# EasyEDA Pro project STC8G1K08A.epro

# Schematic Schematic1
Create Date: 2022-10-18; Page Name: P1; Project Name: STC8G1K08A; Schematic Name: Schematic1; Update Date: 2022-10-23; Company: 嘉立创EDA; Page Size: A4; Version: V1.0
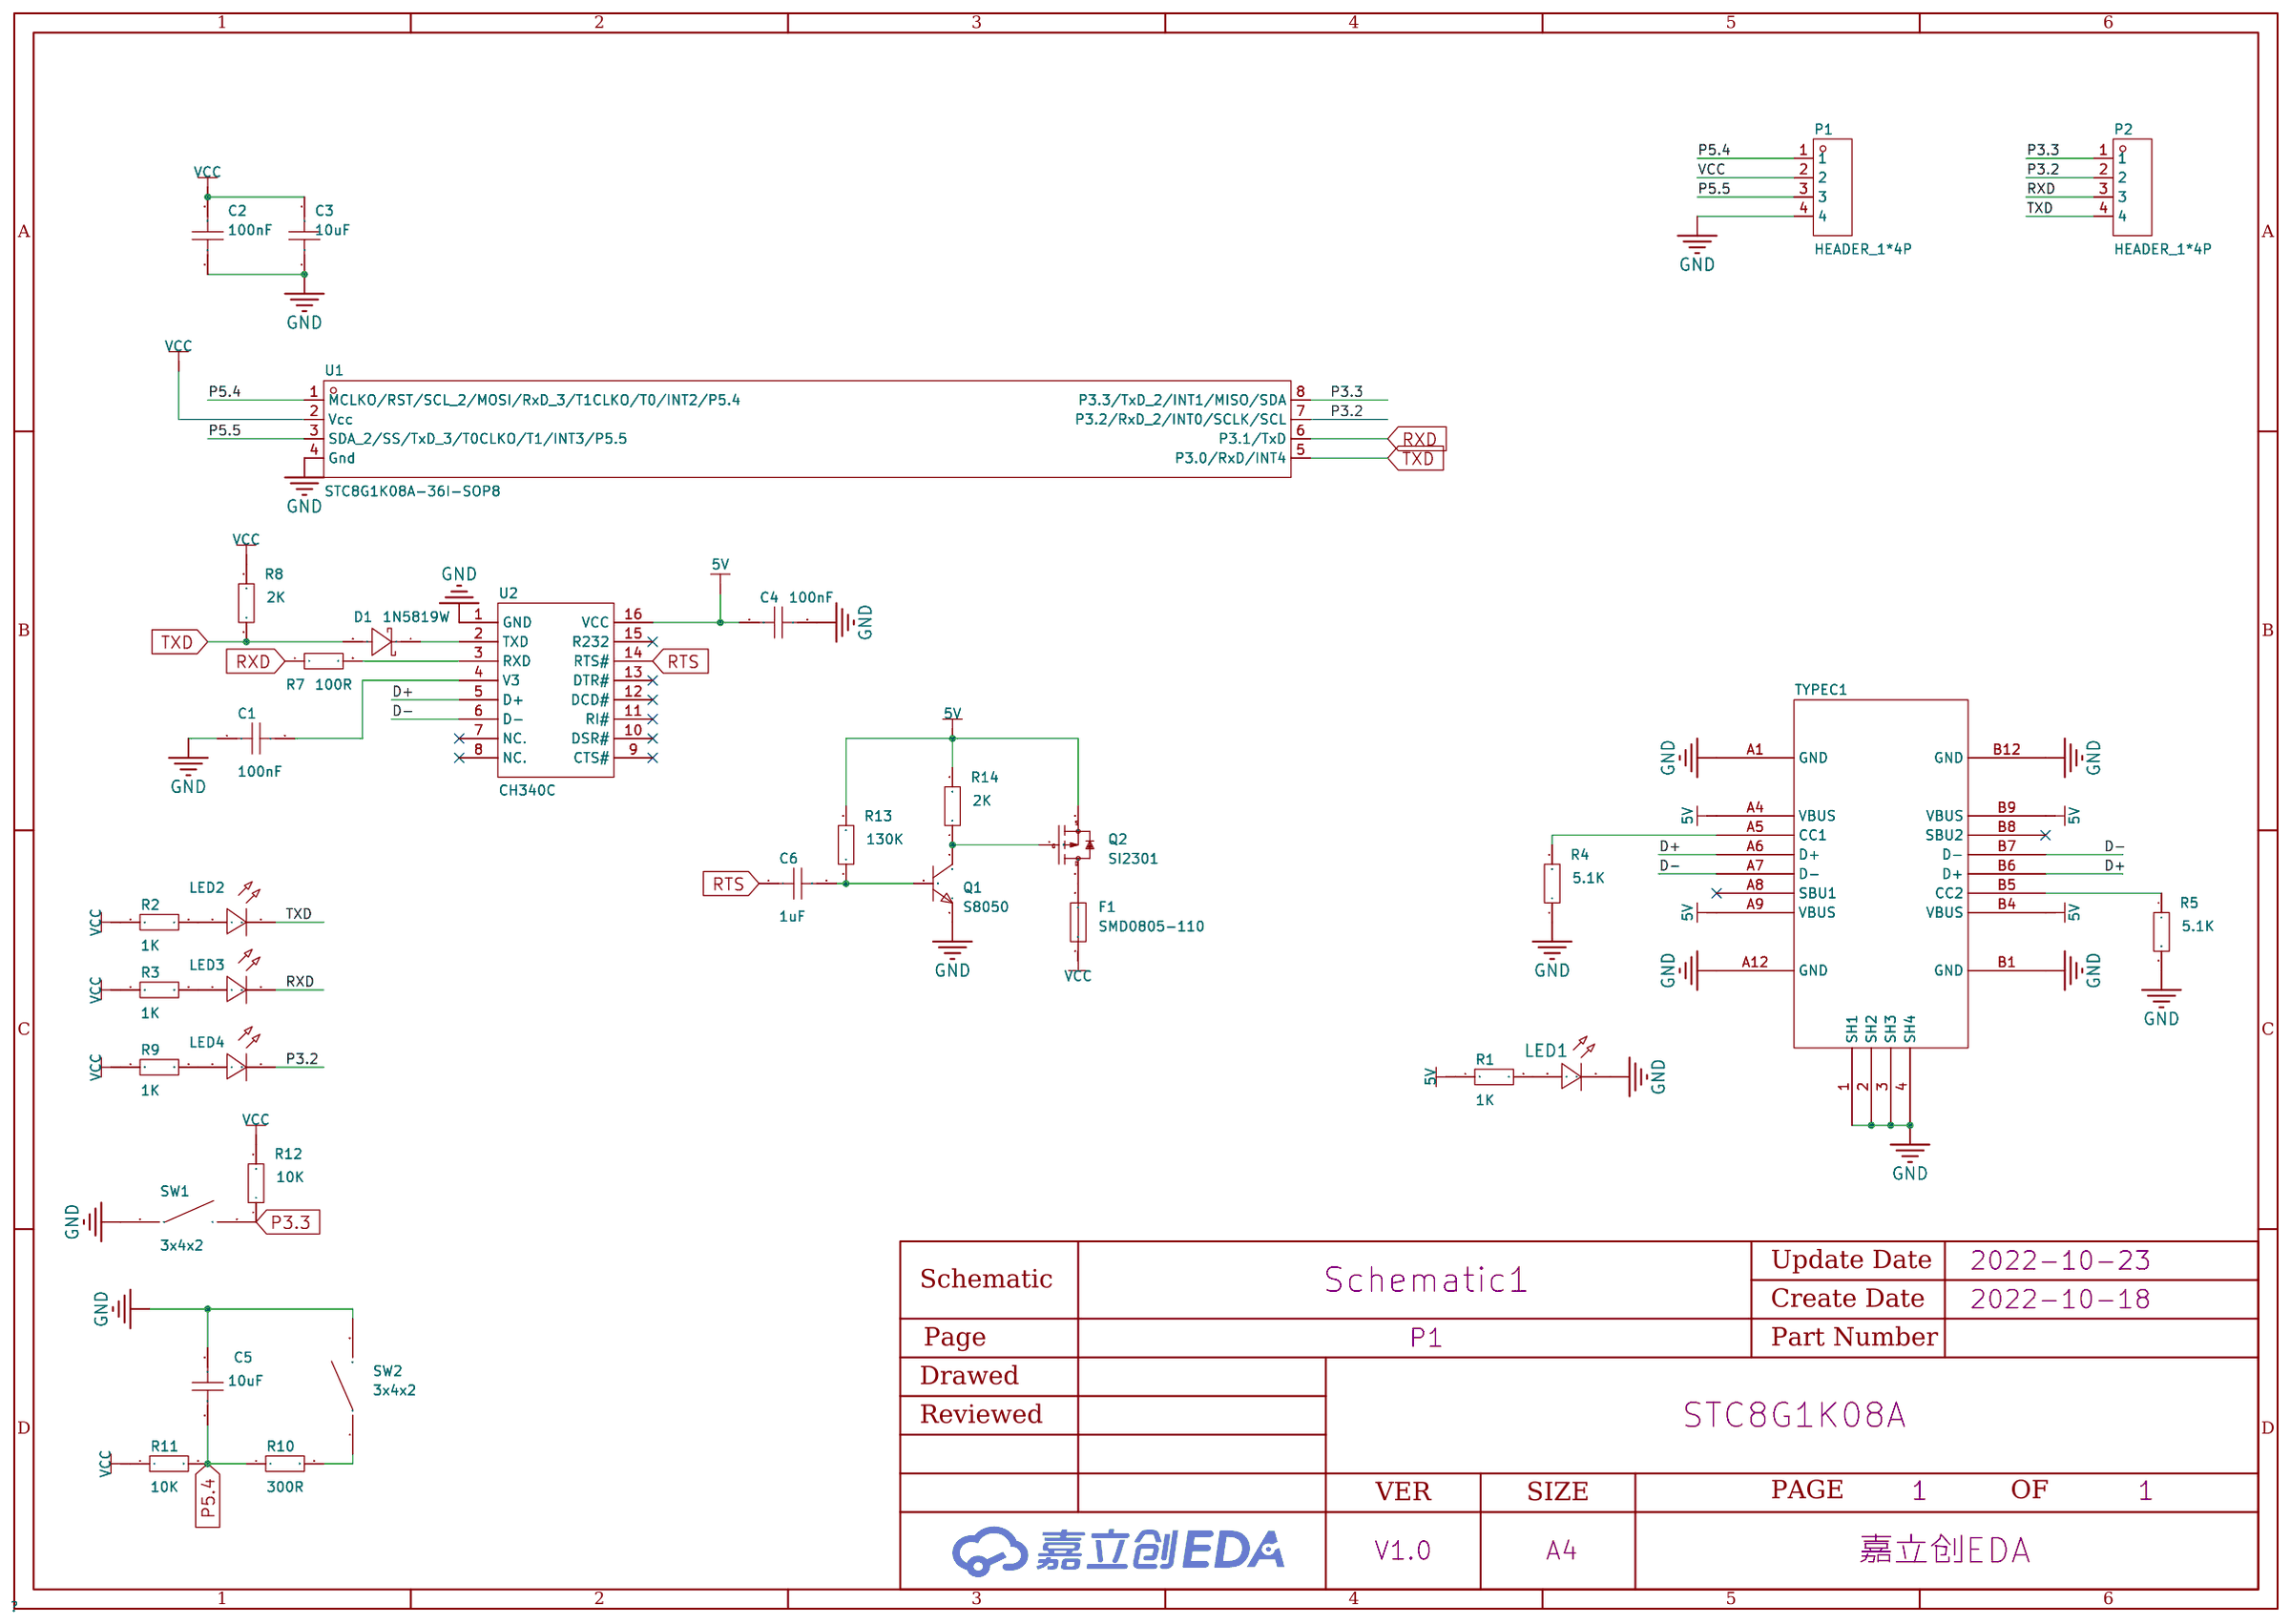
[diagram p0: schematic sheet]

## Parts
C1  100nF  [C0603]
C2  100nF  [C0603]
C3  100nF  [C0603]
C4  100nF  [C0603]
C5  100nF  [C0603]
C6  100nF  [C0603]
D1  1N5819W  [SOD-323_L1.7-W1.3-LS2.6-RD-1]
F1  SMD0805-110  [F0805]
LED1  -  [LED0805-RD_RED]
LED2  -  [LED0805-RD_RED]
LED3  -  [LED0805-RD_RED]
LED4  -  [LED0805-RD_RED]
P1  HEADER_1*4P  [HDR-TH_4P-P2.54-V-M-1]
P2  HEADER_1*4P  [HDR-TH_4P-P2.54-V-M-1]
Q1  S8050  [SOT-23-3_L2.9-W1.3-P1.90-LS2.4-BR]
Q2  SI2301  [SOT-23-3_L2.9-W1.6-P1.90-LS2.8-BR]
R1  10K  [R0603]
R2  10K  [R0603]
R3  10K  [R0603]
R4  10K  [R0603]
R5  10K  [R0603]
R7  10K  [R0603]
R8  10K  [R0603]
R9  10K  [R0603]
R10  10K  [R0603]
R11  10K  [R0603]
R12  10K  [R0603]
R13  10K  [R0603]
R14  10K  [R0603]
SW1  3x4x2  [SW-SMD_L4.0-W2.9-LS5.0]
SW2  3x4x2  [SW-SMD_L4.0-W2.9-LS5.0]
TYPEC1  -  [TypeC-16p]
U1  STC8G1K08A-36I-SOP8  [SOP-8_L5.0-W4.0-P1.27-LS6.0-BL]
U2  CH340C  [SOP-16_L10.0-W3.9-P1.27-LS6.0-BL]

## Library data of the parts
C1-C6 = CAP_0603: Supplier Footprint: 0603
D1 = 1N5819WS S4: 二极管配置:-;直流反向耐压(Vr):40V;平均整流电流(Io):350mA;正向压降(Vf):600mV@200mA;反向电流(Ir):5A@30V;; LCSC Part Name: 40V 350mA 600mV@200mA; Supplier Part: C2939001; Manufacturer: KUU; Supplier Footprint: SOD-323; JLCPCB Part Class: 扩展库; Datasheet: https://atta.szlcsc.com/upload/public/pdf/source/20220104/284BA42B17809E9E0DF150FD0918852F.pdf; Supplier: LCSC; Reverse Voltage (Vr): 40V; Average Rectified Current (Io): 350mA; Forward Voltage (Vf@If): 600mV@200mA; Reverse Leakage Current (Ir): 5A@30V
F1 = SMD0805-110_C883453: 最大电压:6V;最大电流:100A;保持电流:1.1A;跳闸电流:2.2A;消耗功率:600mW;初始态阻值(最小值):60mΩ;跳断后阻值(最大值):210mΩ;最大动作时间:300ms;工作温度:-40~+85;; Supplier Part: C883453; Manufacturer: DOWO(东沃); Supplier Footprint: 0805; JLCPCB Part Class: 扩展库; Datasheet: https://atta.szlcsc.com/upload/public/pdf/source/20201106/C883453_C41FA8401A960BEA648423C0D5CB40C3.pdf; Supplier: LCSC; Operating Voltage (Max): 6V; Current Rating (Max): 100A; Hold Current: 1.1A; Trip Current: 2.2A; Power Dissipation: 600mW; Resistance - Initial (Ri) (Min): 60mΩ; Resistance - Post Trip (R1) (Max): 210mΩ; Maximum Time to Trip: 300ms; Operating Temperature: -40~+85
LED1 = LED_0805-R: Supplier Footprint: 0805
LED2 = LED_0805-G: Supplier Footprint: 0805
LED3 LED4 = LED_0805-B: Supplier Footprint: 0805
P1 P2 = HEADER_1*4P: Supplier Part: C9900003200; Supplier Footprint: TH-4P; JLCPCB Part Class: 扩展库; Datasheet: https://atta.szlcsc.comnull; Supplier: LCSC
Q1 = S8050: NPN 25V 500mA 120-400 SOT-23; Supplier Part: C2931719; Manufacturer: Doeshare(德芯); Supplier Footprint: SOT-23; JLCPCB Part Class: 扩展库; Datasheet: https://atta.szlcsc.com/upload/public/pdf/source/20220117/E6D3315E0D6ADDB25840BFFAC039C5C0.pdf; Supplier: LCSC
Q2 = SI2301_C2985938: 类型:P沟道;漏源电压(Vdss):20V;连续漏极电流(Id):3A;功率(Pd):1.25W;导通电阻(RDS(on)@Vgs,Id):90mΩ@4.5V,2.8A;阈值电压(Vgs(th)@Id):1V@250uA;栅极电荷(Qg@Vgs):10nC@4.5V;输入电容(Ciss@Vds):589pF@16V;反向传输电容(Crss@Vds):68pF@10V;工作温度:+150@(Tj);; LCSC Part Name: P沟道 20V 3A; Supplier Part: C2985938; Manufacturer: KUU; Supplier Footprint: SOT-23-3L; JLCPCB Part Class: 扩展库; Datasheet: https://atta.szlcsc.com/upload/public/pdf/source/20220328/BAD282C8065BB2F010ED3B5450E4D439.pdf; Supplier: LCSC; Type: P沟道; Drain Source Voltage (Vdss): 20V; Continuous Drain Current (Id): 3A; Power Dissipation (Pd): 1.25W; Drain Source On Resistance (RDS(on)@Vgs,Id): 90mΩ@4.5V,2.8A; Gate Threshold Voltage (Vgs(th)@Id): 1V@250uA; Total Gate Charge (Qg@Vgs): 10nC@4.5V; Input Capacitance (Ciss@Vds): 589pF@16V; Reverse Transfer Capacitance (Crss@Vds): 68pF@10V; Operating Temperature: +150@(Tj)
R1-R5 R7-R14 = Res_0603: Supplier Footprint: 0603
SW1 SW2 = TS-1185-C-A-B-B: 触点电流:50mA;额定电压(DC):12V;绝缘电阻:100mΩ;电路结构:单刀单掷;安装方式:立贴;按钮形状:圆形按钮;按钮/盖帽颜色:蓝色;带灯:无;作用力:260gf;机械寿命:100000;工作温度:-30~+85;开关长度:4mm;开关宽度:3mm;开关高度:2mm;带支架:否;; LCSC Part Name: 3*4*2.0硅胶260gf; Supplier Part: C465999; Manufacturer: XKB Connectivity(中国星坤); Supplier Footprint: SMD; JLCPCB Part Class: 扩展库; Datasheet: https://atta.szlcsc.com/upload/public/pdf/source/20211011/1F231F77C87DDA3AFCA2BCBA34277182.pdf; Supplier: LCSC; Contact Current: 50mA; Voltage Rating (DC): 12V; Insulation Resistance: 100mΩ; Circuit: 单刀单掷; Mounting Style: 立贴; Actuator Style: 圆形按钮; Actuator/Cap Color: 蓝色; With Lamp: 无; Operating Force: 260gf; Mechanical Life: 100000; Operating Temperature: -30~+85; Switch Length: 4mm; Switch Width: 3mm; Switch Height: 2mm; Strike Gundam: 否
TYPEC1 = TypeC-16P
U1 = STC8G1K08A-36I-SOP8: CPU内核:51系列;CPU最大主频:-;工作电压范围:1.9V~5.5V;内部振荡器:有;外部时钟频率范围:-;程序 FLASH容量:8KB;RAM总容量:1.25KB;EEPROM/数据 FLASH容量:4KB;GPIO端口数量:6;ADC(单元数/通道数/位数):1@x6ch/10bit;DAC(单元数/通道数/位数):-;(E)PWM(单元数/通道数/位数):-;8位Timer数量:-;16位Timer数量:2;32位Timer数量:-;内部比较器数量:-;U(S)ART路数:1;I2C路数:1;; Supplier Part: C915663; Manufacturer: STC(宏晶); Supplier Footprint: SOP-8; JLCPCB Part Class: 扩展库; Datasheet: https://atta.szlcsc.com/upload/public/pdf/source/20201105/C713818_1666C7558605C197DBF08446D241F69F.pdf; Supplier: LCSC; CPU Core: 51系列; Supply Voltage Range: 1.9V~5.5V; Internal Oscillator: 有; Program FLASH Size: 8KB; RAM Size: 1.25KB; EEPROM/Data FLASH Size: 4KB; GPIO Ports Number: 6; ADC (Units/Channels/bits): 1@x6ch/10bit; 16Bit Timer Number: 2; U(S)ART Number: 1; I2C Number: 1; (Q)SPI Number: 1; Peripherals / Functions / Protocol Stacks: 低电压检测；看门狗；CCP捕获/比较；除法器；乘法器; Operating Temperature Range: -40~+85
U2 = CH340C: 类型:Transceiver;协议类别:USB 2.0;驱动器/接收器数:-;数据速率:2Mbps;; Supplier Part: C84681; Manufacturer: WCH(南京沁恒); Supplier Footprint: SOP-16_150mil; JLCPCB Part Class: 扩展库; Datasheet: https://atta.szlcsc.com/upload/public/pdf/source/20200819/C84681_ADBED554CE321879DBD6B1D06488689C.pdf; Supplier: LCSC; Type: Transceiver; Protocol: USB 2.0; Data Rate: 2Mbps; Supply Voltage: 3.3V, 5V

## Nets
5V: C4.2 Q2.2(S) R1.1 R13.2 R14.2 TYPEC1.A4(VBUS) TYPEC1.A9(VBUS) TYPEC1.B4(VBUS) TYPEC1.B9(VBUS) U2.16(VCC)
GND: C1.1 C2.1 C3.1 C4.1 C5.2 LED1.1(C) P1.4 Q1.2(E) R4.1 R5.2 SW1.1 SW2.2 TYPEC1.1(SH1) TYPEC1.2(SH2) TYPEC1.3(SH3) TYPEC1.4(SH4) TYPEC1.A1(GND) TYPEC1.A12(GND) TYPEC1.B1(GND) TYPEC1.B12(GND) U1.4(Gnd) U2.1(GND)
VCC: C2.2 C3.2 F1.1 P1.2 R2.1 R3.1 R8.2 R9.1 R11.1 R12.2 U1.2(Vcc)
D+: TYPEC1.A6(D+) TYPEC1.B6(D+) U2.5(D+)
D-: TYPEC1.A7(D-) TYPEC1.B7(D-) U2.6(D-)
P3.2: LED4.1(C) P2.2 U1.7(P3.2/RxD_2/INT0/SCLK/SCL)
P3.3: P2.1 R12.1 SW1.2 U1.8(P3.3/TxD_2/INT1/MISO/SDA)
P5.4: C5.1 P1.1 R10.1 R11.2 U1.1(MCLKO/RST/SCL_2/MOSI/RxD_3/T1CLKO/T0/INT2/P5.4)
P5.5: P1.3 U1.3(SDA_2/SS/TxD_3/T0CLKO/T1/INT3/P5.5)
RTS: C6.1 U2.14(RTS#)
RXD: LED3.1(C) P2.3 R7.1 U1.6(P3.1/TxD)
TXD: D1.2(A) LED2.1(C) P2.4 R8.1 U1.5(P3.0/RxD/INT4)
$1N592: D1.1(K) U2.2(TXD)
$1N595: R7.2 U2.3(RXD)
$1N789: C1.2 U2.4(V3)
$1N1194: LED1.2(A) R1.2
$1N1502: LED2.2(A) R2.2
$1N1582: LED3.2(A) R3.2
$1N2420: R4.2 TYPEC1.A5(CC1)
$1N2553: R5.1 TYPEC1.B5(CC2)
$1N5948: LED4.2(A) R9.2
$1N6605: R10.2 SW2.1
$1N7429: C6.2 Q1.1(B) R13.1
$1N7705: Q1.3(C) Q2.1(G) R14.1
$1N8303: F1.2 Q2.3(D)

Not connected (* = marked no-connect by the designer): TYPEC1 A8(SBU1)* B8(SBU2)*; U2 7(NC.)* 8(NC.)* 9(CTS#)* 10(DSR#)* 11(RI#)* 12(DCD#)* 13(DTR#)* 15(R232)*

# Board PCB1
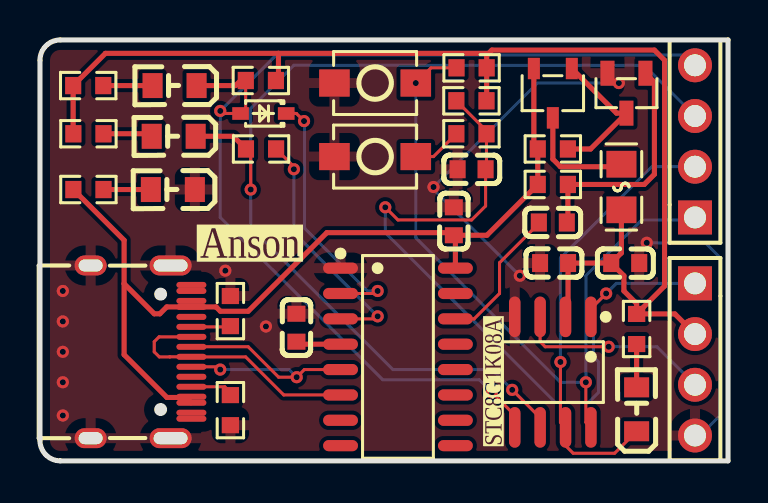
[diagram p1: board, top side]
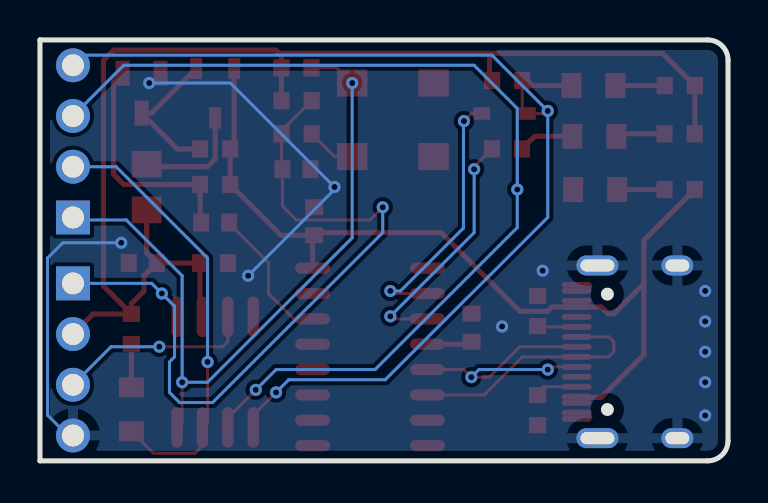
[diagram p2: board, bottom side, seen from below]

Outline 34.42 x 21.08 mm; copper layers: Top Layer, Bottom Layer. Coordinates in mm from the lower left corner of the outline.
Outline path: 0,20.07 arc(0.3,20.78) 1.02,21.08 34.42,21.08 34.42,0 1.02,0 arc(0.3,0.3) 0,1.02 0,20.07
Stack: Top Layer 0.035mm / Dielectric1 1.51mm FR4 er 4.5 / Bottom Layer 0.035mm

## Design rules (mm)
spacing safeClearance (default): track to track 0.152, other pairs 0.152 to 0.3
track width trackWidth (default): min 0.127, default 0.254, max 2.54
differential pair differentialPair (default): width min 0.127, default 0.254, max 2.54; gap min 0.152, default 0.152
via viaSize (default): diameter min 0.5, default 0.61, max 10; hole min 0.3, default 0.305, max 6
net GND uses copperRegion1

## Placement (name value [footprint] x y rotation side)
C1  100nF  [C0603]  12.83 6.67 270 top
C2  100nF  [C0603]  25.72 9.91 0 top
C3  100nF  [C0603]  29.27 9.91 180 top
C4  100nF  [C0603]  20.7 12 270 top
C5  100nF  [C0603]  21.59 14.6 180 top
C6  100nF  [C0603]  25.65 11.94 0 top
D1  1N5819W  [SOD-323_L1.7-W1.3-LS2.6-RD-1]  11.18 17.4 180 top
F1  SMD0805-110  [F0805]  29.08 13.72 90 top
LED1  -  [LED0805-RD_RED]  6.65 13.59 180 top
LED2  -  [LED0805-RD_RED]  6.73 18.8 180 top
LED3  -  [LED0805-RD_RED]  6.69 16.26 180 top
LED4  -  [LED0805-RD_RED]  29.84 2.58 90 top
P1  HEADER_1*4P  [HDR-TH_4P-P2.54-V-M-1]  32.77 5.08 270 top
P2  HEADER_1*4P  [HDR-TH_4P-P2.54-V-M-1]  32.77 16 90 top
Q1  S8050  [SOT-23-3_L2.9-W1.3-P1.90-LS2.4-BR]  29.34 18.41 90 top
Q2  SI2301  [SOT-23-3_L2.9-W1.6-P1.90-LS2.8-BR]  25.65 18.41 90 top
R1  10K  [R0603]  2.42 13.59 0 top
R2  10K  [R0603]  2.41 18.8 0 top
R3  10K  [R0603]  2.42 16.38 0 top
R4  10K  [R0603]  9.52 7.5 270 top
R5  10K  [R0603]  9.52 2.54 270 top
R7  10K  [R0603]  11.06 15.62 0 top
R8  10K  [R0603]  11.05 19.05 0 top
R9  10K  [R0603]  29.84 6.6 270 top
R10  10K  [R0603]  21.58 16.38 180 top
R11  10K  [R0603]  21.58 18.03 180 top
R12  10K  [R0603]  21.59 19.68 0 top
R13  10K  [R0603]  25.65 13.84 180 top
R14  10K  [R0603]  25.65 15.62 180 top
SW1  3x4x2  [SW-SMD_L4.0-W2.9-LS5.0]  16.76 18.92 0 top
SW2  3x4x2  [SW-SMD_L4.0-W2.9-LS5.0]  16.76 15.24 180 top
TYPEC1  -  [TypeC-16p]  4.06 5.46 180 top
U1  STC8G1K08A-36I-SOP8  [SOP-8_L5.0-W4.0-P1.27-LS6.0-BL]  25.65 4.44 180 top
U2  CH340C  [SOP-16_L10.0-W3.9-P1.27-LS6.0-BL]  17.91 5.21 270 top

## Footprints (pads in the part's own frame, mm; a bottom-side part is the same pattern mirrored in y, then rotated)
C0603
  rect 0.8x0.9 smd: 1(-0.7,0) 2(0.7,0)
F0805
  rect 1.335x1.5 smd: 1(-1.143,0) 2(1.143,0)
HDR-TH_4P-P2.54-V-M-1
  rect 1.7x1.7 hole 1.1: 1(-3.81,0)
  round 1.7 hole 1.1: 2(-1.27,0) 3(1.27,0) 4(3.81,0)
LED0805-RD_RED
  rect 1x1.25 smd: 1(-1.1,0) 2(1.1,0)
R0603
  rect 0.806x0.864 smd: 1(-0.753,0) 2(0.753,0)
SOD-323_L1.7-W1.3-LS2.6-RD-1
  rect 0.831x0.63 smd: 1(-1.141,0) 2(1.141,0)
SOP-8_L5.0-W4.0-P1.27-LS6.0-BL
  oval 0.574x2.035 smd: 1(-1.905,-2.768) 2(-0.635,-2.768) 3(0.635,-2.768) 4(1.905,-2.768) 5(1.905,2.768) 6(0.635,2.768) 7(-0.635,2.768) 8(-1.905,2.768)
SOP-16_L10.0-W3.9-P1.27-LS6.0-BL
  oval 0.56x1.745 smd: 1(-4.445,-2.873) 2(-3.175,-2.873) 3(-1.905,-2.873) 4(-0.635,-2.873) 5(0.635,-2.873) 6(1.905,-2.873) 7(3.175,-2.873) 8(4.445,-2.873) 9(4.445,2.873) 10(3.175,2.873) 11(1.905,2.873) 12(0.635,2.873) 13(-0.635,2.873) 14(-1.905,2.873) 15(-3.175,2.873) 16(-4.445,2.873)
SOT-23-3_L2.9-W1.3-P1.90-LS2.4-BR
  rect 1.25x0.7 smd: 1(1,-0.95) 2(1,0.95) 3(-1,0)
SOT-23-3_L2.9-W1.6-P1.90-LS2.8-BR
  rect 1.07x0.6 smd: 1(1.235,-0.95) 2(1.235,0.95) 3(-1.235,0)
SW-SMD_L4.0-W2.9-LS5.0
  rect 1.53x1.36 smd: 1(-2.035,0) 2(2.035,0)
TypeC-16p
  oval 2.1x1 hole 1.7x0.6: 1(-2.47,-4.325) 4(-2.47,4.325)
  oval 1.6x1 hole 1.2x0.6: 2(1.53,-4.325) 3(1.53,4.325)
  rrect 1.5x0.3 smd: A1(-3.51,-3.35) A4(-3.51,-2.55) A5(-3.51,-1.25) A6(-3.51,-0.25) A7(-3.51,0.25) A8(-3.51,1.25) A9(-3.51,2.55) A12(-3.51,3.35) B1(-3.51,3.05) B4(-3.51,2.25) B5(-3.51,1.75) B6(-3.51,0.75) B7(-3.51,-0.75) B8(-3.51,-1.75) B9(-3.51,-2.25) B12(-3.51,-3.05)

## Nets
As in the schematic.

Pads without a net: TYPEC1 A8 B8; U2 7 8 9 10 11 12 13 15

## Via types
v1: diameter 0.61, hole 0.305, Top Layer to Bottom Layer, 27 vias

## Routing (per net, layer and track width the routed paths; a pad name or vN(x,y) marks a point on that pad's centre or on a via; arc(x,y) is an arc through that point)
5V: length 45.5
  Top Layer w0.254: U2.16 20.78,11.22 20.7,11.3 ; 20.7,11.3 20.57,11.43 14.35,11.43 10.41,7.49 9.02,7.49 8.81,7.71 TYPEC1.B9 6.34,7.71 6,7.37 5.72,7.37 4.21,8.87 ; 20.7,11.3 22.36,11.3 R13.2 R14.2 24.7,15.82 Q2.2 ; 20.7,11.3 C4.2 ; 4.21,8.87 4.21,11.05 R1.1 ; 4.21,8.87 4.21,5.32 6.35,3.17 7.31,3.17 TYPEC1.A9
GND: length 31.2
  Bottom Layer w0.152: P1.4 32.89,1.4 33.15,1.4 34.04,2.29 34.04,3.81 34.04,3.81 34.04,10.16 33.27,10.92 v1(30.35,10.92) ; v1(24,9.27) 19.69,13.59 v1(19.69,13.72) 24.89,18.92 v1(28.96,18.92)
  vias: v1(1.14,8.51) v1(1.14,6.98) v1(1.14,5.46) v1(1.14,3.94) v1(1.14,2.27) v1(9.27,9.52) v1(11.3,6.73)
VCC: length 64.3
  Top Layer w0.254: 22.44,20.41 11.93,20.41 ; 22.44,20.41 22.34,20.31 R12.2 22.34,18.04 R11.1 ; 22.44,20.41 22.61,20.57 30.73,20.57 31.24,20.07 31.24,8.75 R9.1 ; 11.93,20.41 11.93,19.18 R8.2 ; 11.93,20.41 3.27,20.41 R2.1 1.66,16.39 R3.1 ; C3.2 29.08,10.41 F1.1 ; C3.2 29.21,9.27 29.21,8.51 29.84,7.87 R9.1 ; C3.2 26.42,9.91 26.42,7.34 U1.2 ; P1.2 31.76,7.36 R9.1
D+: length 14.1
  Top Layer w0.152: TYPEC1.A6 7.58,5.71 10.41,5.71 11.94,4.19 v1(12.84,4.19) 13.22,4.57 15.42,4.57 ; v1(9.02,4.57) 8.88,4.71 TYPEC1.B6
  Bottom Layer w0.152: v1(12.84,4.19) 12.46,4.57 v1(9.02,4.57)
D-: length 12.3
  Top Layer w0.152: 14.65,3.3 12.19,3.3 10.29,5.21 7.58,5.21 TYPEC1.A7 6.49,5.21 6.49,5.21 5.97,5.21 5.72,5.46 5.72,5.97 5.96,6.21 TYPEC1.B7
P3.2: length 22.3
  Top Layer w0.152: LED4.1 28.74,0.38 26.67,0.38 26.29,0.76 U1.7 26.03,1.93 v1(26.03,4.95)
  Bottom Layer w0.152: v1(26.03,4.95) 26.03,10.16 30.61,14.73 P2.2
P3.3: length 36
  Top Layer w0.152: v1(18.8,18.92) 19.56,19.68 R12.1 ; U1.8 27.3,1.93 v1(27.3,3.94)
  Bottom Layer w0.152: v1(18.8,18.92) 18.8,11.17 26.03,3.94 v1(27.3,3.94) 27.3,9.27 30.1,12.06 32.64,12.06 P2.1
P5.4: length 38.6
  Top Layer w0.152: 20.83,18.03 22.33,16.53 R10.1 22.33,14.65 C5.1 22.29,12.77 21.59,12.06 17.91,12.06 v1(17.27,12.7) ; v1(28.32,8.38) 27.56,7.62 U1.1
  Bottom Layer w0.152: P1.1 28.83,8.89 v1(28.32,8.38) 27.69,7.75 27.69,5.21 27.94,4.95 27.94,3.43 27.43,2.92 25.78,2.92 17.27,11.43 v1(17.27,12.7)
P5.5: length 9.9
  Top Layer w0.152: v1(28.45,5.71) 25.27,5.71 25.02,5.97 U1.3
  Bottom Layer w0.152: P1.3 30.86,5.71 v1(28.45,5.71)
RTS: length 7.1
  Top Layer w0.152: 24.95,11.94 24.95,11.89 22.99,9.92 22.99,8.38 21.72,7.11 U2.14
RXD: length 54
  Top Layer w0.152: U1.6 25.02,2.16 v1(23.62,3.56) ; v1(10.54,13.59) 10.54,15.38 R7.1
  Top Layer w0.254: R7.1 9.67,16.26 LED3.1
  Bottom Layer w0.152: P2.3 30.23,19.81 12.7,19.81 10.54,17.65 v1(10.54,13.59) 10.54,11.68 17.65,4.57 22.61,4.57 v1(23.62,3.56)
TXD: length 55.5
  Top Layer w0.152: 10.42,19.05 10.29,18.91 10.29,17.65 D1.2 9.14,17.4 v1(9.02,17.53) ; U1.5 23.75,2.29 v1(22.61,3.43)
  Top Layer w0.254: LED2.1 9.78,18.8 10.04,19.05 10.42,19.05
  Bottom Layer w0.152: v1(22.61,3.43) 21.97,4.06 17.14,4.06 9.02,12.19 v1(9.02,17.53) 11.81,20.32 32.26,20.32 P2.4
$1N592: length 13.3
  Top Layer w0.152: U2.2 16.76,8.38 v1(16.89,8.51) ; D1.1 12.83,17.4 v1(13.21,17.02)
  Bottom Layer w0.152: v1(13.21,17.02) 13.23,16.99 13.23,11.66 16.38,8.51 v1(16.89,8.51)
$1N595: length 12.4
  Top Layer w0.152: R7.2 12.7,14.73 v1(12.7,14.6) ; U2.3 16.76,7.11 v1(16.89,7.24)
  Bottom Layer w0.152: v1(12.7,14.6) 12.7,11.43 v1(16.89,7.24)
$1N789: length 1.8
  Top Layer w0.254: 14.65,5.84 12.83,5.84
$1N1194: length 2.4
  Top Layer w0.254: R1.2 LED1.2
$1N1502: length 2.5
  Top Layer w0.254: R2.2 LED2.2
$1N1582: length 2.5
  Top Layer w0.254: R3.2 5.46,16.38 LED3.2
$1N2420: length 2
  Top Layer w0.152: 9.52,6.75 9.49,6.71 TYPEC1.A5
$1N2553: length 2.4
  Top Layer w0.152: R5.1 9.53,3.3 9.65,3.3 9.24,3.71 TYPEC1.B5
$1N5948: length 2.2
  Top Layer w0.254: R9.2 LED4.2
$1N6605: length 2.5
  Top Layer w0.152: SW2.1 19.69,15.24 20.83,16.38
$1N7429: length 11.7
  Top Layer w0.254: Q1.1 30.73,18.97 30.73,14.35 30.23,13.84 R13.1 26.41,11.99 C6.2
$1N7705: length 7.3
  Top Layer w0.254: Q2.1 28.84,17.41 Q1.3 27.54,15.62 R14.1
$1N8303: length 5.7
  Top Layer w0.254: F1.2 28.96,14.73 26.03,14.73 25.65,15.11 Q2.3

## Copper pours and planes (outline as drawn; the poured copper is in the pictures)
GND on Top Layer: 0,21.24 34.04,21.24 34.04,0 0,0
GND on Bottom Layer: -0.13,21.21 34.04,21.21 34.04,0 -0.13,0

## Text on the board
Top Silkscreen Layer: STC8G1K08A | Anson
